# EAGLE design lcd20x4_left (EAGLE 7.2.0)
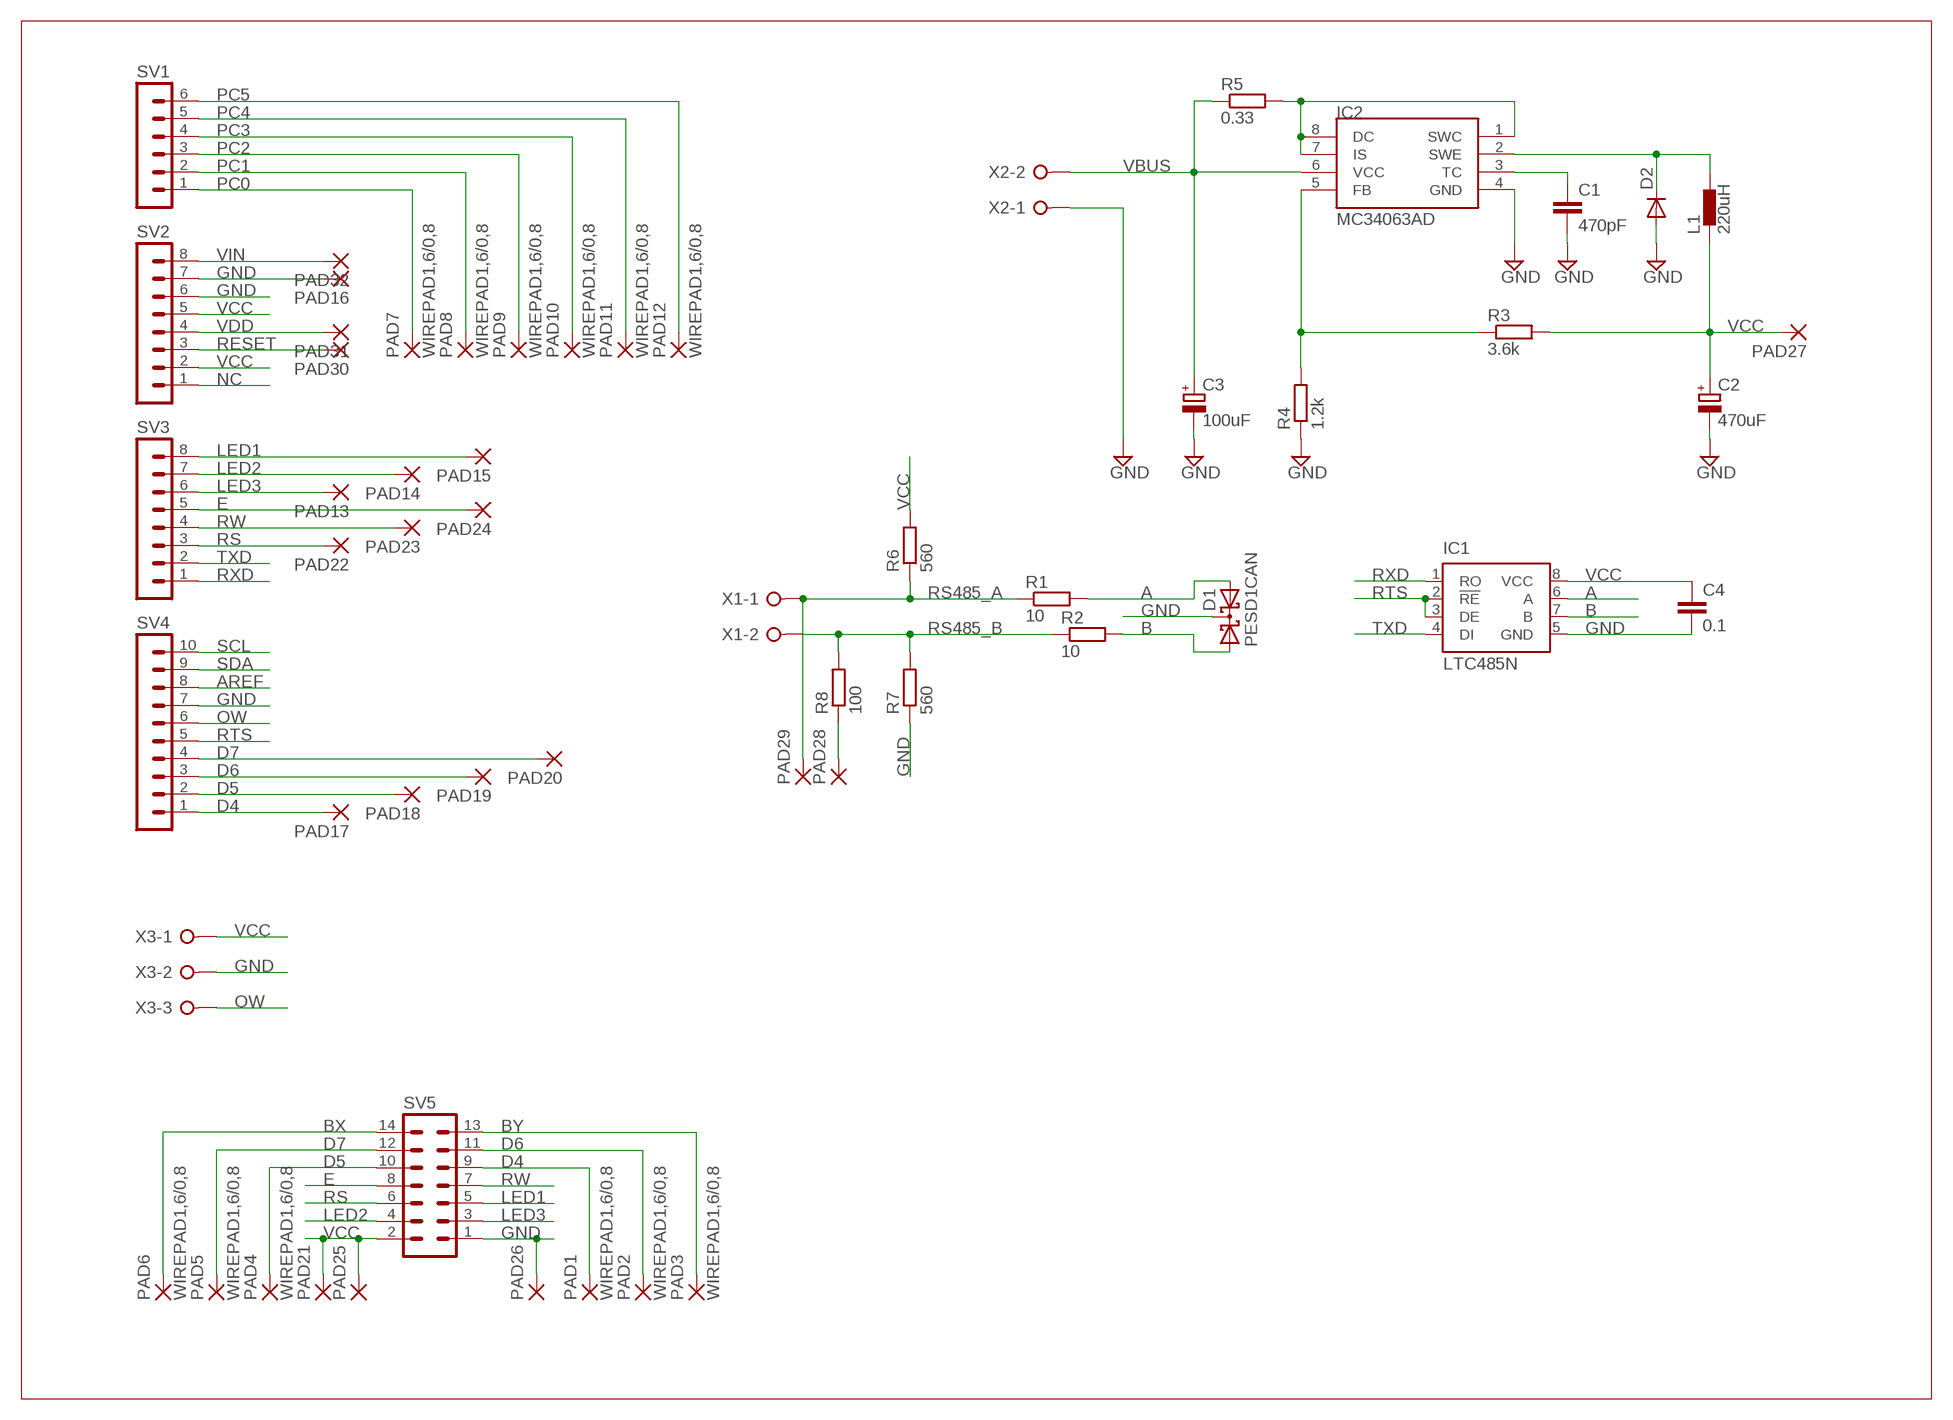
[diagram p0: schematic, sheet 1]

## Parts
C1  470pF  C-EUC0805  [C0805]
C2  470uF  CPOL-EUE3.5-8  [E3,5-8]
C3  100uF  CPOL-EUE3.5-8  [E3,5-8]
C4  0.1  C-EUC0805  [C0805]
D1  PESD1CAN  BAT54C  [SOT23]
D2  DIODE-SMB  [SMB]
IC1  LTC485N  [DIL08]
IC2  MC34063AD  [SOIC8]
L1  220uH  DR1030  [DR1030]
PAD1  WIREPAD1,6/0,8  [1,6/0,8]
PAD2  WIREPAD1,6/0,8  [1,6/0,8]
PAD3  WIREPAD1,6/0,8  [1,6/0,8]
PAD4  WIREPAD1,6/0,8  [1,6/0,8]
PAD5  WIREPAD1,6/0,8  [1,6/0,8]
PAD6  WIREPAD1,6/0,8  [1,6/0,8]
PAD7  WIREPAD1,6/0,8  [1,6/0,8]
PAD8  WIREPAD1,6/0,8  [1,6/0,8]
PAD9  WIREPAD1,6/0,8  [1,6/0,8]
PAD10  WIREPAD1,6/0,8  [1,6/0,8]
PAD11  WIREPAD1,6/0,8  [1,6/0,8]
PAD12  WIREPAD1,6/0,8  [1,6/0,8]
PAD13  WIREPAD1,6/0,8  [1,6/0,8]
PAD14  WIREPAD1,6/0,8  [1,6/0,8]
PAD15  WIREPAD1,6/0,8  [1,6/0,8]
PAD16  WIREPAD1,6/0,8  [1,6/0,8]
PAD17  WIREPAD1,6/0,8  [1,6/0,8]
PAD18  WIREPAD1,6/0,8  [1,6/0,8]
PAD19  WIREPAD1,6/0,8  [1,6/0,8]
PAD20  WIREPAD1,6/0,8  [1,6/0,8]
PAD21  WIREPAD1,6/0,8  [1,6/0,8]
PAD22  WIREPAD1,6/0,8  [1,6/0,8]
PAD23  WIREPAD1,6/0,8  [1,6/0,8]
PAD24  WIREPAD1,6/0,8  [1,6/0,8]
PAD25  WIREPAD1,6/0,8  [1,6/0,8]
PAD26  WIREPAD1,6/0,8  [1,6/0,8]
PAD27  WIREPAD1,6/0,8  [1,6/0,8]
PAD28  WIREPAD1,6/0,8  [1,6/0,8]
PAD29  WIREPAD1,6/0,8  [1,6/0,8]
PAD30  WIREPAD1,6/0,8  [1,6/0,8]
PAD31  WIREPAD1,6/0,8  [1,6/0,8]
PAD32  WIREPAD1,6/0,8  [1,6/0,8]
R1  10  R-EU_0207/10  [0207/10]
R2  10  R-EU_0207/10  [0207/10]
R3  3.6k  R-EU_R0805  [R0805]
R4  1.2k  R-EU_R0805  [R0805]
R5  0.33  R-EU_M1206  [M1206]
R6  560  R-EU_0207/10  [0207/10]
R7  560  R-EU_0207/10  [0207/10]
R8  100  R-EU_0207/10  [0207/10]
SV1  MA06-1  [MA06-1]
SV2  MA08-1  [MA08-1]
SV3  MA08-1  [MA08-1]
SV4  MA10-1  [MA10-1]
SV5  MA07-2  [MA07-2]
X1  W237-02P  [W237-132]
X2  W237-02P  [W237-132]
X3  W237-03P  [W237-133]

## Nets
A: D1.2(A2) IC1.6(A) R1.2
AREF: SV4.8
B: D1.1(A1) IC1.7(B) R2.2
BX: PAD6.1(P) SV5.14
BY: PAD3.1(P) SV5.13
D4: PAD1.1(P) PAD17.1(P) SV4.1 SV5.9
D5: PAD4.1(P) PAD18.1(P) SV4.2 SV5.10
D6: PAD2.1(P) PAD19.1(P) SV4.3 SV5.11
D7: PAD5.1(P) PAD20.1(P) SV4.4 SV5.12
E: PAD24.1(P) SV3.5 SV5.8
GND: C1.2 C2.- C3.- C4.2 D1.3(CC) D2.A IC1.5(GND) IC2.4(GND) PAD16.1(P) PAD26.1(P) R4.1 R7.1 SV2.6 SV2.7 SV4.7 SV5.1 X2.1 X3.2
LED1: PAD15.1(P) SV3.8 SV5.5
LED2: PAD14.1(P) SV3.7 SV5.4
LED3: PAD13.1(P) SV3.6 SV5.3
N$1: C1.1 IC2.3(TC)
N$2: D2.C IC2.2(SWE) L1.2
N$3: IC2.1(SWC) IC2.7(IS) IC2.8(DC) R5.2
N$4: IC2.5(FB) R3.1 R4.2
N$5: PAD28.1(P) R8.1
NC: SV2.1
OW: SV4.6 X3.3
PC0: PAD7.1(P) SV1.1
PC1: PAD8.1(P) SV1.2
PC2: PAD9.1(P) SV1.3
PC3: PAD10.1(P) SV1.4
PC4: PAD11.1(P) SV1.5
PC5: PAD12.1(P) SV1.6
RESET: PAD30.1(P) SV2.3
RS: PAD22.1(P) SV3.3 SV5.6
RS485_A: PAD29.1(P) R1.1 R6.1 X1.1
RS485_B: R2.1 R7.2 R8.2 X1.2
RTS: IC1.2(!RE) IC1.3(DE) SV4.5
RW: PAD23.1(P) SV3.4 SV5.7
RXD: IC1.1(RO) SV3.1
SCL: SV4.10
SDA: SV4.9
TXD: IC1.4(DI) SV3.2
VBUS: C3.+ IC2.6(VCC) R5.1 X2.2
VCC: C2.+ C4.1 IC1.8(VCC) L1.1 PAD21.1(P) PAD25.1(P) PAD27.1(P) R3.2 R6.2 SV2.2 SV2.5 SV5.2 X3.1
VDD: PAD31.1(P) SV2.4
VIN: PAD32.1(P) SV2.8

## Library data of the parts
C1 C4 = rcl:C-EU: CAPACITOR, European symbol
C2 C3 = rcl:CPOL-EU: POLARIZED CAPACITOR, European symbol
D1 = diode:BAT54C: Schottky Diodes Source: Fairchild .. BAT54.pdf
D2 = diode:DIODE-: DIODE
IC1 = linear-technology:LTC485: Low Power RS485 Interface Transceiver Source: http://www.linear.com/pc/downloadDocument.do?navId=H0,C1,C1007,C1017,P2064,D1718; OC_FARNELL: unknown; OC_NEWARK: unknown
IC2 = mc34063:MC34063
L1 = inductors:DR1030: DR1030 Series Low Profile Power Inductors Source: Data sheet <http://www.cooperbussmann.com/pdf/c73e479f-f867-4c64-ae26-9c1f23814163.pdf>
PAD1-PAD32 = wirepad:WIREPAD: Wire PAD connect wire on PCB
R1-R8 = rcl:R-EU_: RESISTOR, European symbol
SV1 = con-lstb:MA06-1: PIN HEADER; OC_FARNELL: unknown; OC_NEWARK: unknown
SV2 SV3 = con-lstb:MA08-1: PIN HEADER; OC_FARNELL: unknown; OC_NEWARK: unknown
SV4 = con-lstb:MA10-1: PIN HEADER; OC_FARNELL: unknown; OC_NEWARK: unknown
SV5 = con-lstb:MA07-2: PIN HEADER; OC_FARNELL: unknown; OC_NEWARK: unknown
X1 X2 = con-wago-508:W237-02P: WAGO SREW CLAMP; OC_FARNELL: unknown; OC_NEWARK: unknown
X3 = con-wago-508:W237-03P: WAGO SREW CLAMP; OC_FARNELL: unknown; OC_NEWARK: unknown

## Board
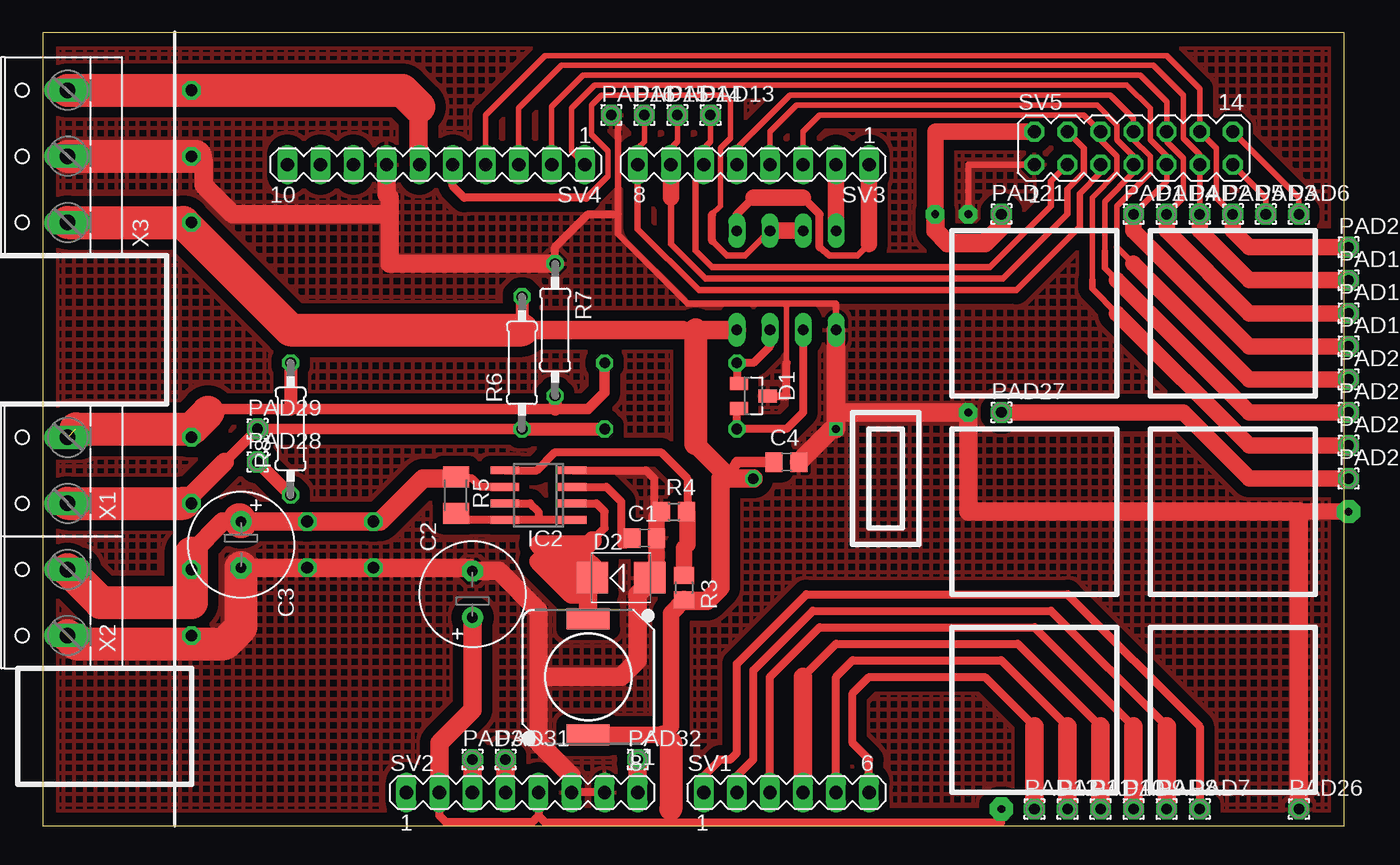
[diagram p1: board, top side]
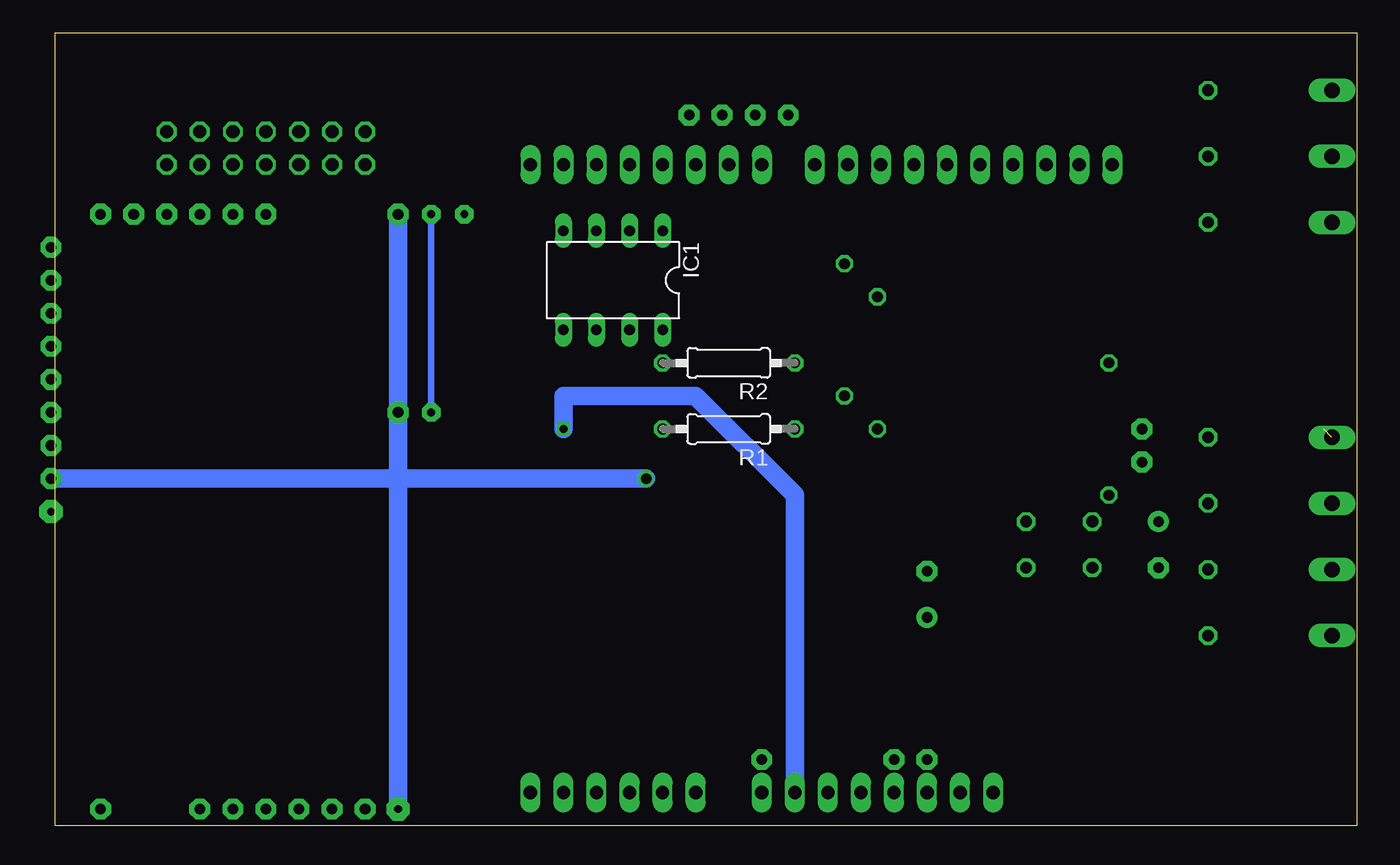
[diagram p2: board, bottom side, seen from below]

Size 100 x 60.95 mm. Coordinates in mm from the lower left corner, seen from the top.
Outline: 0,0 100,0 100,60.95 0,60.95 0,0
Copper layers (1*16): Top 0.035mm / dielectric 1.5mm / Bottom 0.035mm
Design rules "default": minimum track width 10mil, minimum drill 24mil, track to track 8mil, track to pad 8mil, pad to pad 8mil, via to via 8mil, smd to smd 8mil, copper to edge 40mil, drill to drill 8mil, minimum pad ring 10mil, minimum via ring 8mil, stop-mask expansion 4mil, vias tented up to drill 0mil, thermal gap 10mil

### Footprints (pad centres in the part's own frame; a part is rotated, then mirrored left to right if it is on the bottom)
C0805 = smd 1.3 x 1.5: 1 -0.95,0; 2 0.95,0
E3,5-8 = drill 0.813 pad 1.6: + -1.778,0 | drill 0.813 pad 1.6 octagon: - 1.778,0
SOT23 = smd 1 x 1.4: 1 -0.95,-1.1; 2 0.95,-1.1; 3 0,1.1
SMB = smd 2.4 x 2.4: A 2.2,0; C -2.2,0
DIL08 = drill 0.813 long: 1 -3.81,-3.81; 2 -1.27,-3.81; 3 1.27,-3.81; 4 3.81,-3.81; 5 3.81,3.81; 6 1.27,3.81; 7 -1.27,3.81; 8 -3.81,3.81
SOIC8 = smd 0.6 x 2.2: 1 -1.905,-2.6; 2 -0.635,-2.6; 3 0.635,-2.6; 4 1.905,-2.6; 5 1.905,2.6; 6 0.635,2.6; 7 -0.635,2.6; 8 -1.905,2.6
DR1030 = smd 3.3 x 1.6: 1 0,4.45; 2 0,-4.45
1,6/0,8 = drill 0.813 pad 1.6 octagon: 1 0,0
0207/10 = drill 0.813 octagon: 1 -5.08,0; 2 5.08,0
R0805 = smd 1.3 x 1.5: 1 -0.95,0; 2 0.95,0
M1206 = smd 1.6 x 2: 1 -1.4,0; 2 1.4,0
MA06-1 = drill 1.016 long: 1 -6.35,0; 2 -3.81,0; 3 -1.27,0; 4 1.27,0; 5 3.81,0; 6 6.35,0
MA08-1 = drill 1.016 long: 1 -8.89,0; 2 -6.35,0; 3 -3.81,0; 4 -1.27,0; 5 1.27,0; 6 3.81,0; 7 6.35,0; 8 8.89,0
MA10-1 = drill 1.016 long: 1 -11.43,0; 2 -8.89,0; 3 -6.35,0; 4 -3.81,0; 5 -1.27,0; 6 1.27,0; 7 3.81,0; 8 6.35,0; 9 8.89,0; 10 11.43,0
MA07-2 = drill 1.016 octagon: 1 -7.62,-1.27; 2 -7.62,1.27; 3 -5.08,-1.27; 4 -5.08,1.27; 5 -2.54,-1.27; 6 -2.54,1.27; 7 0,-1.27; 8 0,1.27; 9 2.54,-1.27; 10 2.54,1.27; 11 5.08,-1.27; 12 5.08,1.27; 13 7.62,-1.27; 14 7.62,1.27
W237-132 = drill 1.194 long: 1 -2.54,-0.635; 2 2.54,-0.635
W237-133 = drill 1.194 long: 1 -5.08,-0.635; 2 0,-0.635; 3 5.08,-0.635

### Placement (x,y rotation side)
C1  46.23,22.1 0 top
C2  33.02,17.78 90 top
C3  15.24,21.59 270 top
C4  57.15,27.94 0 top
D1  54.61,33.02 270 top
D2  44.45,19.05 0 top
IC1  57.15,41.91 180 bottom
IC2  38.1,25.4 90 top
L1  41.91,11.43 180 top
PAD1  83.82,46.99 0 top
PAD2  88.9,46.99 0 top
PAD3  93.98,46.99 0 top
PAD4  86.36,46.99 0 top
PAD5  91.44,46.99 0 top
PAD6  96.52,46.99 0 top
PAD7  88.9,1.27 0 top
PAD8  86.36,1.27 0 top
PAD9  83.82,1.27 0 top
PAD10  81.28,1.27 0 top
PAD11  78.74,1.27 0 top
PAD12  76.2,1.27 0 top
PAD13  51.31,54.61 0 top
PAD14  48.77,54.61 0 top
PAD15  46.23,54.61 0 top
PAD16  43.69,54.61 0 top
PAD17  100.33,36.83 0 top
PAD18  100.33,39.37 0 top
PAD19  100.33,41.91 0 top
PAD20  100.33,44.45 0 top
PAD21  73.66,46.99 0 top
PAD22  100.33,29.21 0 top
PAD23  100.33,31.75 0 top
PAD24  100.33,34.29 0 top
PAD25  100.33,26.67 0 top
PAD26  96.52,1.27 0 top
PAD27  73.66,31.75 0 top
PAD28  16.51,27.94 0 top
PAD29  16.51,30.48 0 top
PAD30  33.02,5.08 0 top
PAD31  35.56,5.08 0 top
PAD32  45.72,5.08 0 top
R1  48.26,30.48 180 bottom
R2  48.26,35.56 180 bottom
R3  49.28,18.29 270 top
R4  48.51,24.13 0 top
R5  31.75,25.4 270 top
R6  36.83,35.56 90 top
R7  39.37,38.1 270 top
R8  19.05,30.48 90 top
SV1  57.15,2.54 0 top
SV2  36.83,2.54 0 top
SV3  54.61,50.8 180 top
SV4  30.23,50.8 180 top
SV5  83.82,52.07 0 top
X1  1.27,27.3 90 top
X2  1.27,17.14 90 top
X3  1.27,51.44 90 top

### Tracks (layer width: path | path; a pad name or v marks a point on that pad's centre or on a via)
A
  Top 0.61: D1.2 53.34,31.9 R1.2 57.15,30.48 58.42,31.75 IC1.6
B
  Top 0.61: IC1.7 55.88,36.83 54.61,35.56 R2.2 53.34,34.14 D1.1
BX
  Top 0.406: SV5.14 96.52,48.26 PAD6.1
BY
  Top 0.406: SV5.13 93.98,48.26 PAD3.1
D4
  Top 0.406: SV4.1 40.64,51.82 40.64,55.12 42.42,56.9 83.31,56.9 85.09,55.12 85.09,52.7 86.36,51.44 SV5.9 86.36,49.53 PAD1.1
  Top 1.27: PAD17.1 92.71,36.83 83.82,45.72 PAD1.1
D5
  Top 0.406: SV4.2 39.12,55.24 41.53,57.66 84.33,57.66 86.36,55.63 SV5.10 86.36,52.58 87.63,51.31 87.63,48.26 PAD4.1
  Top 1.27: PAD18.1 92.71,39.37 86.36,45.72 PAD4.1
D6
  Top 0.406: SV4.3 36.58,55.12 39.88,58.42 85.34,58.42 87.63,56.13 87.63,52.83 88.9,51.56 SV5.11 PAD2.1
  Top 1.27: PAD19.1 92.71,41.91 88.9,45.72 PAD2.1
D7
  Top 0.406: SV4.4 34.04,54.61 38.61,59.18 86.36,59.18 88.9,56.64 SV5.12 90.17,52.07 90.17,48.26 PAD5.1
  Top 1.27: PAD20.1 92.71,44.45 91.44,45.72 PAD5.1
E
  Top 0.406: SV3.5 53.34,52.07 57.4,56.13 82.04,56.13 83.82,54.36 SV5.8 83.82,52.7 85.09,51.44 85.09,50.16 82.55,47.62 82.55,44.45
  Top 0.508: 83.82,43.18 82.55,44.45
  Top 1.27: PAD24.1 92.71,34.29 83.82,43.18
GND  (via drill 0.6, 0.6 pad 1.42, 0.6 pad 1.78, 0.9 pad 1.42)
  Top 0.406: 57.15,35.56 57.15,40.13 | PAD16.1 44.2,54.1
  Top 0.508: IC1.5 60.96,40.13 57.15,40.13 49.53,40.13 44.2,45.47 44.2,46.99 44.2,54.1 | v71.12,46.99 71.12,50.8 SV5.1
  Top 0.61: D1.3 57.15,33.02 57.15,35.56 | 43.18,3.81 SV2.7 SV2.6 | IC2.4 46.35,27.3 46.99,26.67 46.99,24.7 R4.1 | R7.1 39.37,44.45 41.91,46.99 44.2,46.99
  Top 0.813: C4.2 v60.96,30.48
  Top 1.27: D2.A 47.18,19.58 C1.2 47.18,23.74 R4.1 | 96.52,24.13 v100.33,24.13
  Top 1.422: D2.A 46.65,18.71 45.72,17.78 45.72,12.7 44.45,11.43 38.1,11.43 | C3.- v20.32,19.81 v25.4,19.81 32.77,19.81 C2.- 35.05,19.56 38.1,16.51 38.1,11.43 | 38.1,11.43 38.1,6.35 40.64,3.81 SV2.6 | IC1.5 60.96,31.75 | 60.96,31.75 v60.96,30.48 60.64,30.48 C4.2 | PAD26.1 96.52,24.13 71.12,24.13 v71.12,31.75 60.96,31.75 | 26.67,46.99 14.61,46.99 12.38,49.21 12.38,51.12 11.75,51.44 | 26.67,46.99 26.67,48.26 26.42,48.51 SV4.7 | R7.1 26.67,43.18 26.67,46.99
  Top 2.54: X2.1 2.54,13.97 13.97,13.97 15.24,15.24 C3.- | X3.2 v11.43,51.44 11.75,51.44
  Bottom 0.508: v71.12,46.99 v71.12,31.75
  Bottom 1.422: SV2.7 43.18,25.4 50.8,33.02 60.96,33.02 v60.96,30.48
  pour Top (isolate 0.813, hatched): 0,0 100.33,0 100.33,59.69 0,59.69
LED1
  Top 0.406: SV3.8 45.72,52.07 46.23,52.58 PAD15.1 | 81.28,50.16 SV5.5
  Top 0.508: SV3.8 45.72,45.85 50.42,41.15 74.8,41.15 79.69,46.04 79.69,48.58 81.28,50.16
LED2
  Top 0.406: SV3.7 48.26,52.07 48.77,52.58 PAD14.1
  Top 0.508: 48.26,48.26 48.26,44.7 50.93,42.04 73.79,42.04 78.74,46.99 78.74,48.9 80.01,50.16 80.01,52.07 SV5.4
  Top 1.27: SV3.7 48.26,48.26
LED3
  Top 0.406: SV3.6 50.8,52.07 51.31,52.58 PAD13.1
  Top 0.508: SV3.6 50.8,50.16 50.16,49.53 50.16,44.2 51.44,42.93 72.77,42.93 77.47,47.62 77.47,49.53 SV5.3
N$1
  Top 0.61: IC2.3 43.31,26.04 44.45,24.89 44.45,21.59 44.77,21.59 C1.1
N$2
  Top 0.61: 42.25,21.93 43.18,22.86 43.18,24.13 42.55,24.77 IC2.2
  Top 1.422: 42.25,21.93 41.91,21.59 38.1,21.59 39.37,20.32 41.91,20.32 42.25,19.98 D2.C 39.37,19.05 | 38.1,20.32 39.37,19.05 | 39.37,19.05 40.64,17.78 41.91,17.78 L1.2
N$3
  Top 0.61: IC2.1 38.1,23.5 | 38.1,23.5 IC2.8 32.26,23.5 R5.2 | IC2.7 37.47,24.77 38.1,24.13 38.1,23.5
N$4
  Top 0.61: IC2.5 37.97,27.3 39.37,28.7 47.5,28.7 49.53,26.67 49.53,24.2 R4.2
  Top 1.27: R3.1 49.28,21.34 49.53,21.59 49.53,24.06 R4.2
N$5
  Top 1.016: PAD28.1 R8.1
N$6  (via drill 0.9 pad 1.42)
  other vias: 11.43,14.61
N$7  (via drill 0.9 pad 1.42)
  other vias: 11.43,24.77
N$8  (via drill 0.9 pad 1.42)
  other vias: 11.43,29.84
N$9  (via drill 0.9 pad 1.42)
  other vias: 11.43,46.35
OW  (via drill 0.9 pad 1.42)
  Top 1.422: SV4.6 28.89,50.86 28.89,55.24
  Top 2.54: X3.3 v11.43,56.52 27.62,56.52 28.89,55.24
PC0
  Top 0.61: PAD7.1 88.9,7.62 78.74,17.78 58.67,17.78 53.34,12.45 53.34,5.59 52.83,5.08 52.07,5.08 50.8,3.81 SV1.1
PC1
  Top 0.61: 86.36,7.62 77.47,16.51 59.18,16.51 54.61,11.94 54.61,5.08 53.34,3.81 SV1.2
  Top 1.422: 86.36,7.62 PAD8.1
PC2
  Top 0.61: SV1.3 55.88,11.43 59.69,15.24 76.2,15.24 83.82,7.62
  Top 1.422: 83.82,7.62 PAD9.1
PC3
  Top 0.61: 58.42,11.43 60.96,13.97 74.93,13.97 81.28,7.62
  Top 1.422: SV1.4 58.42,11.43 | 81.28,7.62 PAD10.1
PC4
  Top 0.61: SV1.5 60.96,11.43 62.23,12.7 73.66,12.7 78.74,7.62
  Top 1.422: 78.74,7.62 PAD11.1
PC5
  Top 0.61: SV1.6 63.5,5.08 62.23,6.35 62.23,10.16 63.5,11.43 72.39,11.43 76.2,7.62
  Top 1.422: 76.2,7.62 PAD12.1
RESET
  Top 1.422: PAD30.1 SV2.3
RS
  Top 0.406: SV3.3 58.42,53.34 59.69,54.61 80.01,54.61 SV5.6 81.28,52.7 82.55,51.44 82.55,50.16 80.64,48.26 80.64,41.91
  Top 0.508: 82.55,39.37 80.64,41.27 80.64,41.91
  Top 1.27: PAD22.1 92.71,29.21 82.55,39.37
RS485_A
  Top 0.813: R6.1 PAD29.1 13.97,27.94
  Top 1.016: R6.1 R1.1
  Top 1.422: 10.79,24.77 13.97,27.94
  Top 2.54: X1.1 10.79,24.77
RS485_B  (1 unrouted)
  Top 0.813: R2.1 43.18,33.27 41.91,32 39.37,32 19.05,32 12.95,32 12.7,31.75
  Top 1.016: R7.2 39.37,32 | R8.2 19.05,32
  Top 2.54: 2.54,30.48 11.43,30.48 12.7,31.75
RTS
  Top 0.406: 51.44,46.99 52.07,47.62 52.07,52.07 52.83,52.83 52.83,55.63 52.32,56.13 42.93,56.13 42.16,55.37 42.16,53.09 43.43,51.82 43.43,49.91 41.78,48.26
  Top 0.508: 51.44,44.96 52.58,43.81 53.98,43.81 IC1.2
  Top 0.61: 51.44,44.96 51.44,46.99 | 41.78,48.26 32.38,48.26 31.5,49.15 SV4.5
  Top 1.27: IC1.2 IC1.3
RW
  Top 0.406: SV3.4 55.88,53.34 57.91,55.37 81.03,55.37 82.55,53.85 82.55,52.7 83.82,51.44 SV5.7 83.82,50.16 81.6,47.94 81.6,44.13
  Top 0.508: 82.55,41.91 81.6,42.86 81.6,44.13
  Top 1.27: PAD23.1 92.71,31.75 82.55,41.91
RXD
  Top 0.508: 63.5,44.7 62.61,43.81 60.45,43.81 59.69,44.45
  Top 0.61: 59.69,44.45 59.69,46.99 58.42,48.26 | 54.61,48.26 53.34,46.99 IC1.1
  Top 1.27: SV3.1 63.5,44.7 | 58.42,48.26 54.61,48.26
TXD
  Top 1.27: IC1.4 SV3.2
VBUS  (via drill 0.9 pad 1.42)
  Top 0.61: IC2.6 33.66,26.04 33.02,26.67 31.88,26.67 R5.1
  Top 1.422: R5.1 31.62,26.67 29.21,26.67 25.91,23.37 v25.4,23.37 v20.32,23.37 C3.+ 13.84,23.37 11.43,20.95
  Top 2.54: X2.2 4.45,17.14 11.43,17.14 v11.43,19.68 11.43,20.95 | 15.11,23.5 C3.+
VCC  (via drill 0.6 pad 1.42, 0.6 pad 1.78, 0.8)
  Top 0.406: 73.66,0.25 v73.66,1.27
  Top 0.61: 38.1,0.76 38.61,0.25 48.26,0.25 | 48.26,0.25 73.66,0.25 | SV2.5 38.1,0.76 | 38.1,0.76 37.59,0.25 30.99,0.25 30.48,0.76 SV2.2 | 48.26,1.27 48.26,0.25 | 48.26,7.62 47.62,6.98
  Top 0.813: 50.16,38.1 49.15,38.1 | C4.1 53.34,27.94 52.7,26.8
  Top 1.016: R6.2 36.83,38.1
  Top 1.27: L1.1 47.62,6.98 | 48.26,7.62 48.26,16.32 R3.2 | v68.58,46.99 68.58,53.34 SV5.2 | PAD27.1 87.63,31.75 92.71,26.67 PAD25.1
  Top 1.422: IC1.8 50.16,38.1 | 50.16,29.34 52.7,26.8 52.07,26.67 | 52.07,26.67 52.07,18.29 51.05,17.27 49.34,17.27 R3.2 | 47.62,6.98 48.26,6.34 | PAD21.1 73.66,46.04 72.39,44.77 69.53,44.77 68.58,45.72 v68.58,46.99 | v54.61,26.67 52.07,26.67 | 36.83,38.1 49.15,38.1 | SV2.2 30.48,6.35 33.02,8.89 C2.+
  Top 1.778: 50.16,38.1 50.16,29.34 | 48.26,6.34 48.26,1.27
  Top 2.54: X3.1 10.79,46.35 19.05,38.1 36.83,38.1
  Bottom 1.422: PAD25.1 v54.61,26.67 | v73.66,1.27 PAD21.1
VDD
  Top 1.422: PAD31.1 SV2.4
VIN
  Top 1.422: SV2.8 PAD32.1